# Altium schematic sheet Analog to Digital.SchDoc
size A; SheetNumber: 6; SheetTotal: 15
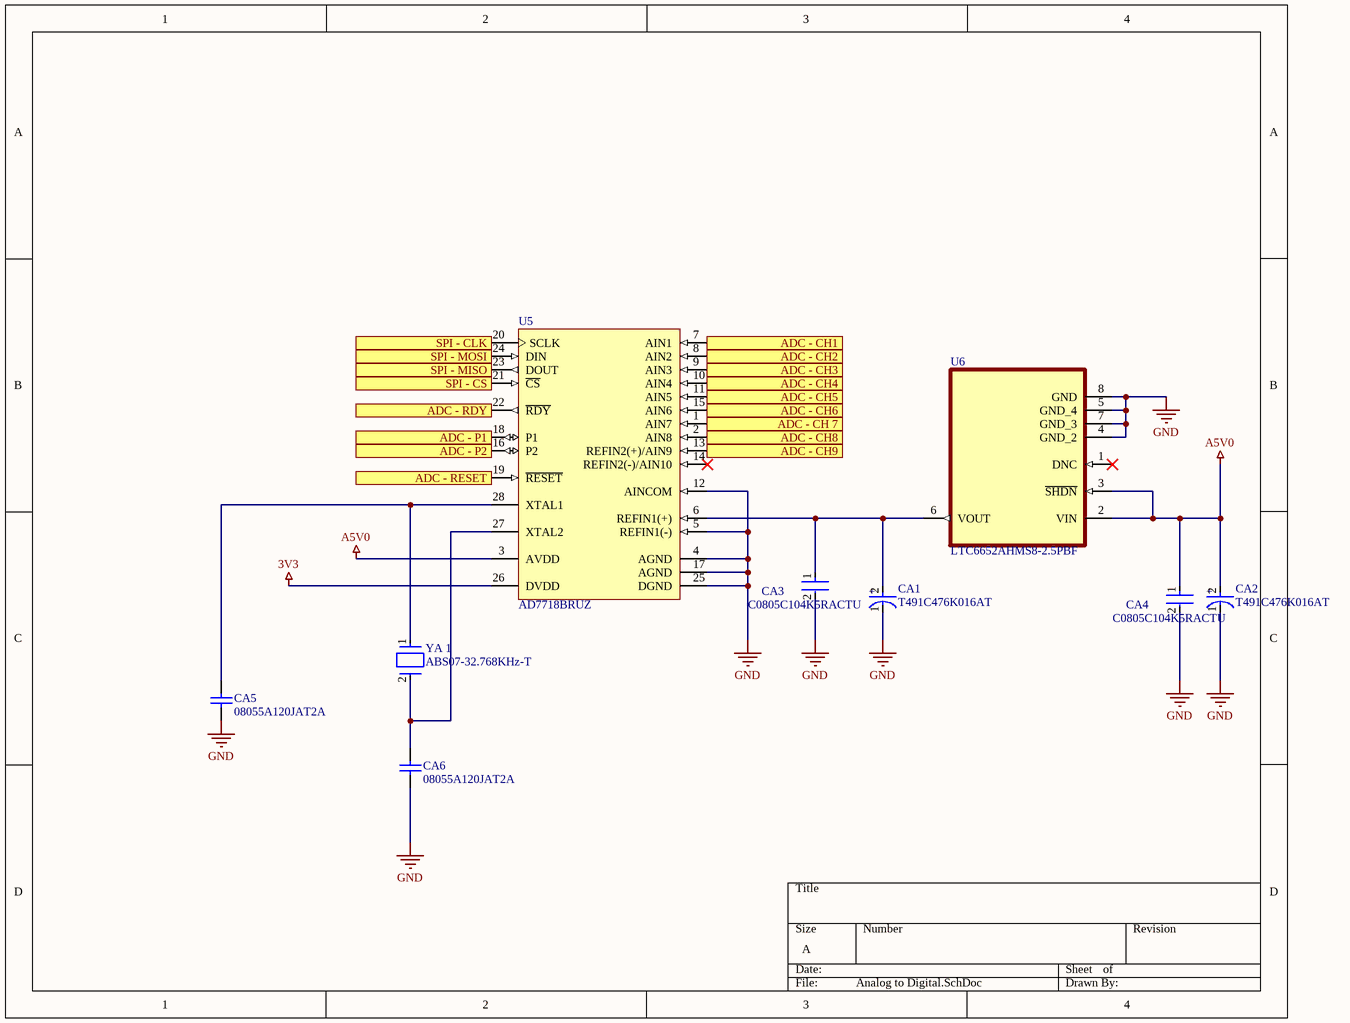
[diagram p0: Analog to Digital.SchDoc]

## Parts
CA1  T491C476K016AT  [FP-T491C476K016AT-MFG]
CA2  T491C476K016AT  [FP-T491C476K016AT-MFG]
CA3  C0805C104K5RACTU  [FP-C0805C-DN-MFG]
CA4  C0805C104K5RACTU  [FP-C0805C-DN-MFG]
CA5  08055A120JAT2A  [CAPC2013X71X50ML20T25]
CA6  08055A120JAT2A  [CAPC2013X71X50ML20T25]
U5  AD7718BRUZ  [RU-28_N]
U6  LTC6652AHMS8-2.5PBF  [SOP65P490X110-8N]
YA_1  ABS07-32.768KHz-T  [FP-ABS07-MFG]

## Ports
ADC - CH1 (in), ADC - CH2 (in), ADC - CH3 (in), ADC - CH4 (in), ADC - CH5 (in), ADC - CH6 (in), ADC - CH8 (in), ADC - CH9 (in), ADC - CH 7 (in), ADC - P1, ADC - P2, ADC - RDY, ADC - RESET, SPI - CLK, SPI - CS, SPI - MISO (out), SPI - MOSI (in)

## Nets
3V3: U5.26(DVDD)
A5V0: CA2.2(A) CA4.1 U5.3(AVDD) U6.2(VIN) U6.3(~{SHDN})
GND: CA1.1(C) CA2.1(C) CA3.2 CA4.2 CA5.1 CA6.1 U5.4(AGND) U5.5(REFIN1(-)) U5.12(AINCOM) U5.17(AGND) U5.25(DGND) U6.4(GND_2) U6.5(GND_4) U6.7(GND_3) U6.8(GND)
ADC - CH1: U5.7(AIN1) ; port ADC - CH1
ADC - CH2: U5.8(AIN2) ; port ADC - CH2
ADC - CH3: U5.9(AIN3) ; port ADC - CH3
ADC - CH4: U5.10(AIN4) ; port ADC - CH4
ADC - CH5: U5.11(AIN5) ; port ADC - CH5
ADC - CH6: U5.15(AIN6) ; port ADC - CH6
ADC - CH8: U5.2(AIN8) ; port ADC - CH8
ADC - CH9: U5.13(REFIN2(+)/AIN9) ; port ADC - CH9
ADC - CH 7: U5.1(AIN7) ; port ADC - CH 7
ADC - P1: U5.18(P1) ; port ADC - P1
ADC - P2: U5.16(P2) ; port ADC - P2
ADC - RDY: U5.22(~{RDY}) ; port ADC - RDY
ADC - RESET: U5.19(~{RESET}) ; port ADC - RESET
SPI - CLK: U5.20(SCLK) ; port SPI - CLK
SPI - CS: U5.21(~{CS}) ; port SPI - CS
SPI - MISO: U5.23(DOUT) ; port SPI - MISO
SPI - MOSI: U5.24(DIN) ; port SPI - MOSI
NetCA1_2: CA1.2(A) CA3.1 U5.6(REFIN1(+)) U6.6(VOUT)
NetCA5_2: CA5.2 U5.28(XTAL1) YA_1.1
NetCA6_2: CA6.2 U5.27(XTAL2) YA_1.2

Not connected (* = marked no-connect by the designer): U5 14(REFIN2(-)/AIN10)*; U6 1(DNC)*

## Notes on the sheet
- (in symbol CMP-03017-000042-1) +

## Library data of the parts
CA1 CA2 = CMP-03017-000042-1: CAP TANT 47UF 10% 16V 2312; Leakage Current: 7.5uA; Dielectric Material: Tantalum; Polarity: Polar; Dissipation Factor: 6%; Tolerance: 20%; ESR (Equivalent Series Resistance): 1.2R; Voltage: 6V; Ripple Current: 303mA; Life (Hours): 2000Hour; Min Operating Temperature: -55°C; Case/Package: Molded; Lead Free: Lead Free; Radiation Hardening: No; Voltage Rating: 16V; Failure Rate: 0.001%; Max Operating Temperature: 125°C; Features: General Purpose; Length: 6mm; REACH SVHC: No SVHC; Package Quantity: 1; Case Code (Metric): 6032; Mount: Surface Mount; Number of Pins: 2; Height: 2.5mm; Termination: SMD/SMT; RoHS Compliant: Yes; Width: 3.2mm; Case Code (Imperial): 2312; Voltage Rating (DC): 16V; Capacitance: 47uF; Depth: 3.2mm; Height - Seated (Max): 0.11inch; Packaging: Tape and Reel
CA3 CA4 = CMP-2007-00279-2: CAP CER 0.1UF 50V X7R 0805; Manufacturer: KEMET; Value: 0.10 μF; Tolerance: 0.1; Temperature Coefficient: 30ppm/°C; Manufacturer Part Number: C0805C104K5RACTU; Device Class L2: Capacitors; Temperature Range Low: -55°C; Voltage Rating: 50 V; Digikey Description: CAP CER 0.1UF 50V X7R 0805; Category: Cap; ComponentLink2Description: Datasheet; Octopart: https://octopart.com/c0805c104k5ractu-kemet-143926; RoHS: TRUE; ComponentLink2URL: https://content.kemet.com/datasheets/KEM_C1003_C0G_SMD.pdf; Temperature Characteristic: X7R; Temperature: -55°C to +125°C; Height: 0.88mm; Temperature Range High: +125°C; Device Class L1: Passive Components; Automotive: No; Lead Free: Yes; Ipc Land Pattern Name: CAPC200125X78; Material: Ceramic; Device Class L3: Ceramic Capacitors; Mouser Description: Cap Ceramic 0.1uF 50V X7R 10% SMD 2.0 x 1.2 mm 125 C Paper T/R; Capacitance: 0.10 μF; Package: C0805C-DN
CA5 CA6 = CMP-2007-04500-1: Manufacturer: AVX Interconnect / Elco; Part Number: 08055A120JAT2A
U5 = CMP-0313-02003-2: 10 Channel 24-Bit Low Power Sigma-Delta Analog-to-Digital Converter with Serial, SPI Interface, 1.365KSPS, -40 to +85 degC, RU-28, Pb-Free, Tube; Manufacturer: Analog Devices; Generic Part Number: AD7718; Interface: Ser, SPI; Resolution (Bits): 24; Channels: 10; Throughput Rate (SPS): 1.365K; PackageVersion: 2005; ComponentLink2URL: http://www.analog.com/static/imported-files/data_sheets/AD7708_7718.pdf; ComponentLink3Description: Package Specification; Packing: Tube; DatasheetVersion: Rev.0; Mounting Technology: Surface Mount; Code_JEDEC: MO-153-AE; ComponentLink3URL: http://www.analog.com/static/imported-files/packages/249854663RU_28.pdf; ComponentLink4Description: Product URL; ComponentLink1Description: Manufacturer URL; ComponentLink2Description: Datasheet; ComponentLink1URL: http://www.analog.com/en/index.html; ComponentLink4URL: http://www.analog.com/en/analog-to-digital-converters/ad-converters/ad7718/products/product.html; PackageReference: RU-28; PartNumber: AD7718BRUZ; RoHS: Y; PackageDescription: 28-Lead Thin Shrink Small Outline Package [TSSOP]
U6 = LTC6652AHMS8-2.5PBF: Ic Vref Series Prec 2.5v 8-Msop - Ltc6652ahms8-2.5#Pbf; MF: Linear Technology; Package: MSOP-8 Linear Technology; Price: None; Availability: Unavailable; MP: LTC6652AHMS8-2.5#PBF; SnapEDA_Link: https://www.snapeda.com/parts/LTC6652AHMS8-2.5%23PBF/Analog%20Devices/view-part/135303/?ref=snap; Value: *
YA_1 = CMP-0447-00001-3: CRYSTAL 32.7680KHZ 12.5PF SMD; Frequency Tolerance: 20ppm; Series Resistance: 70kR; Operating Frequency: 32.768 kHz; Number of Pins: 2; Package Quantity: 3000; Tolerance: 20ppm; Max Operating Temperature: 85°C; Width: 0.061inch; Frequency: 32.768kHz; Termination: SMD/SMT; Min Operating Temperature: -40°C; Radiation Hardening: No; Series: ABS07; Length: 3.2mm; Case/Package: CSMD; ESR (Equivalent Series Resistance): 70kR; RoHS Compliant: Yes; Load Capacitance: 12.5pF; Depth: 1.5mm; REACH SVHC: No SVHC; Height: 0.035inch; Packaging: Tape and Reel; Lead Free: Lead Free